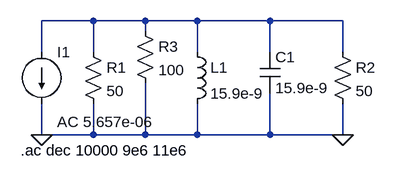
[diagram p0: schematic eje1.asc]
eje1.asc, the LTspice schematic file:
Version 4
SHEET 1 880 680
WIRE 96 64 16 64
WIRE 176 64 96 64
WIRE 256 64 176 64
WIRE 368 64 256 64
WIRE 480 64 368 64
WIRE 176 80 176 64
WIRE 16 112 16 64
WIRE 96 112 96 64
WIRE 256 112 256 64
WIRE 368 112 368 64
WIRE 480 112 480 64
WIRE 16 240 16 192
WIRE 96 240 96 192
WIRE 96 240 16 240
WIRE 176 240 176 160
WIRE 176 240 96 240
WIRE 256 240 256 192
WIRE 256 240 176 240
WIRE 368 240 368 176
WIRE 368 240 256 240
WIRE 480 240 480 192
WIRE 480 240 368 240
FLAG 16 240 0
FLAG 480 240 0
SYMBOL current 16 112 R0
WINDOW 123 24 108 Left 2
WINDOW 39 0 0 Left 2
SYMATTR Value2 AC 5.657e-06
SYMATTR InstName I1
SYMATTR Value ""
SYMBOL res 80 96 R0
SYMATTR InstName R1
SYMATTR Value 50
SYMBOL ind 240 96 R0
SYMATTR InstName L1
SYMATTR Value 15.9e-9
SYMATTR SpiceLine Rser=0
SYMBOL cap 352 112 R0
SYMATTR InstName C1
SYMATTR Value 15.9e-9
SYMATTR SpiceLine Rser=0
SYMBOL res 464 96 R0
SYMATTR InstName R2
SYMATTR Value 50
SYMBOL res 160 64 R0
SYMATTR InstName R3
SYMATTR Value 100
TEXT -16 264 Left 2 !.ac dec 10000 9e6 11e6

The netlist it stands for:
* eje1.asc
I1 N001 0 AC 5.657e-06
R1 N001 0 50
L1 N001 0 15.9e-9 Rser=0
C1 N001 0 15.9e-9 Rser=0
R2 N001 0 50
R3 N001 0 100
.ac dec 10000 9e6 11e6
.backanno
.end